# Altium schematic sheet Sheet1.SchDoc
size A4
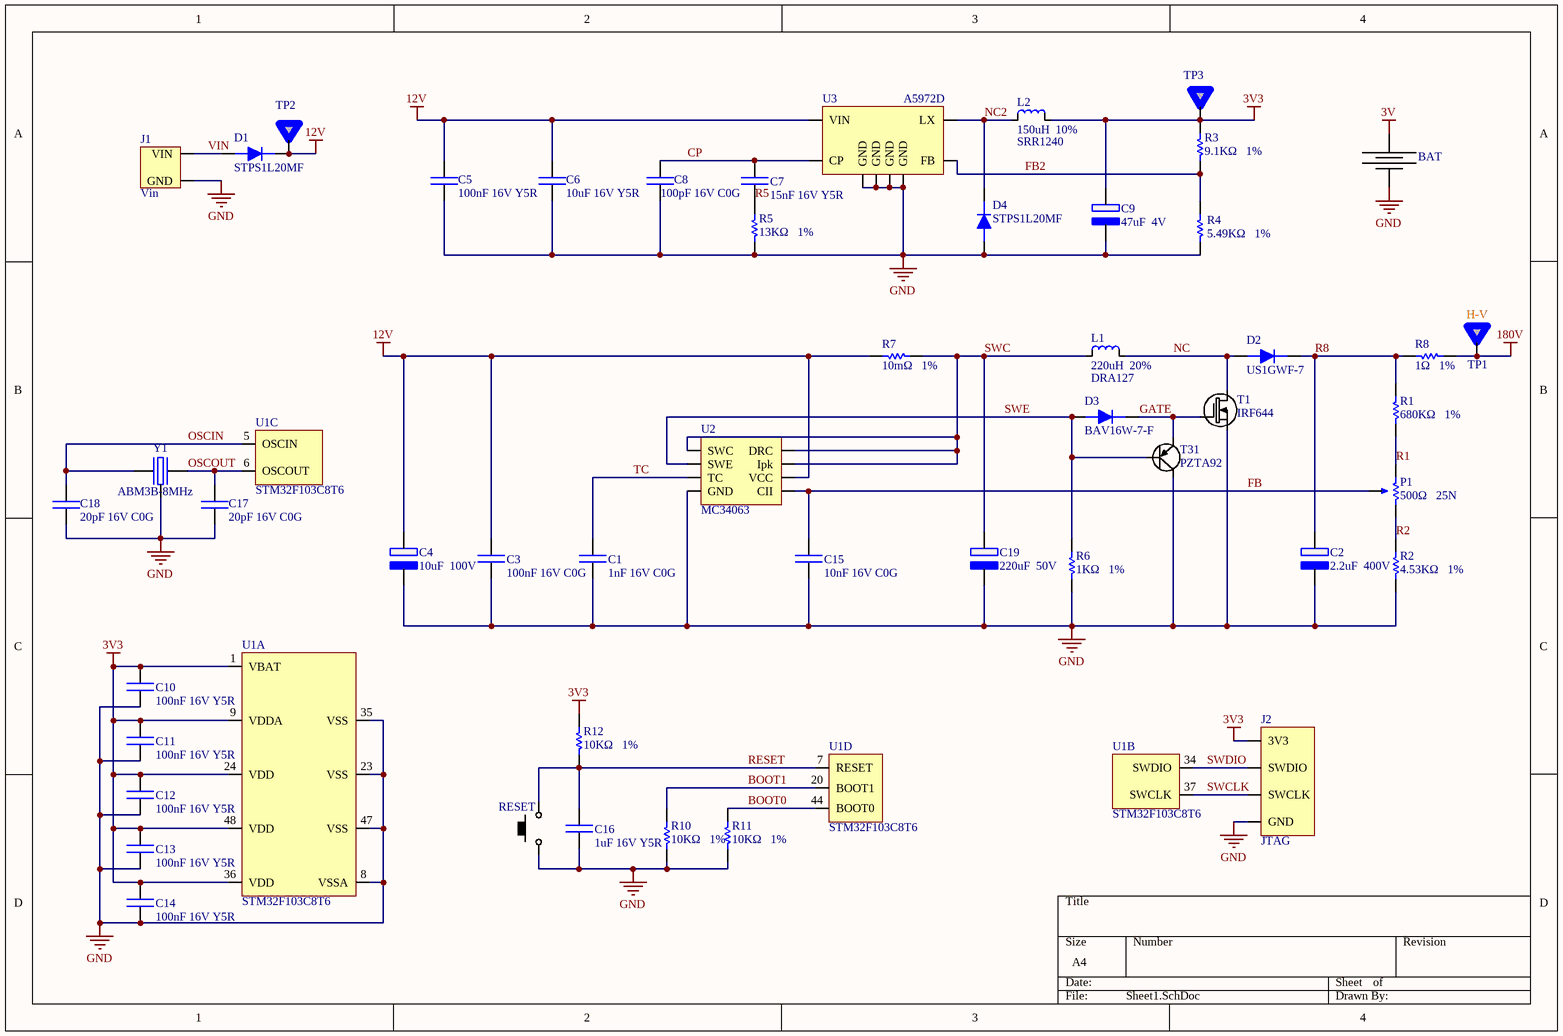
[diagram p0: Sheet1.SchDoc]

## Parts
BAT  3V  [HOLDER-2032]  (value not drawn)
C1  1nF 16V C0G  [0603]
C2  2.2uF  400V  [CAP-SIZE-F]
C3  100nF 16V C0G  [0603]
C4  10uF  100V  [CAP-SIZE-F]
C5  100nF 16V Y5R  [0603]
C6  10uF 16V Y5R  [0603]
C7  15nF 16V Y5R  [0603]
C8  100pF 16V C0G  [0603]
C9  47uF  4V  [AVX-B-CASE]
C10  100nF 16V Y5R  [0603]
C11  100nF 16V Y5R  [0603]
C12  100nF 16V Y5R  [0603]
C13  100nF 16V Y5R  [0603]
C14  100nF 16V Y5R  [0603]
C15  10nF 16V C0G  [0603]
C16  1uF 16V Y5R  [0603]
C17  20pF 16V C0G  [0603]
C18  20pF 16V C0G  [0603]
C19  220uF  50V  [CAP-SIZE-F]
D1  STPS1L20MF  [DO-222AA]
D2  US1GWF-7  [SOD-123F]
D3  BAV16W-7-F  [SOD-123F]
D4  STPS1L20MF  [DO-222AA]
J1  Vin  [BORNERAx2]
J2  JTAG  [PIN-HEADERx4]
L1  220uH  20%  [DRA127]
L2  150uH  10%  [SRR1240]
P1  500Ω   25N  [3296W]
R1  680KΩ   1%  [0603]
R2  4.53KΩ   1%  [0603]
R3  9.1KΩ   1%  [0603]
R4  5.49KΩ   1%  [0603]
R5  13KΩ   1%  [0603]
R6  1KΩ   1%  [0603]
R7  10mΩ   1%  [0603]
R8  1Ω   1%  [0603]
R10  10KΩ   1%  [0603]
R11  10KΩ   1%  [0603]
R12  10KΩ   1%  [0603]
RESET  RESET  [FSMSM]  (value not drawn)
T1  IRF644  [TO263-3S]
T31  PZTA92  [SOT-23]
TP1  HV-TEST-POINT  [Test_Point_HV]  (value not drawn)
TP2  TEST-POINT  [Test_Point]  (value not drawn)
TP3  TEST-POINT  [Test_Point]  (value not drawn)
U1  STM32F103C8T6  [LQFP48]  (parts A,B,C,D of 8)
U2  MC34063  [SOIC-8]
U3  A5972D  [SOIC-8]
Y1  ABM3B-8MHz  [ABM3B]

## Nets
3V: BAT.1(+)
3V3: C9.2 C10.1 C11.1 C12.1 C13.1 C14.1 J2.1(3V3) L2.2 R3.2 R12.2 TP3.1 U1.1(VBAT) U1.9(VDDA) U1.24(VDD) U1.36(VDD) U1.48(VDD)
12V: C3.2 C4.2 C5.2 C6.2 D1.2 R7.1 TP2.1 U2.6(VCC) U3.8(VIN)
180V: R8.2 TP1.1
GND: BAT.2(-) C1.1 C2.1 C3.1 C4.1 C5.1 C6.1 C8.1 C9.1 C10.2 C11.2 C12.2 C13.2 C14.2 C15.1 C16.1 C17.1 C18.1 C19.1 D4.1 J1.2(GND) J2.4(GND) R2.1 R4.2 R5.1 R6.1 R10.1 R11.1 RESET.2 T1.2(S) T31.3(C) U1.8(VSSA) U1.23(VSS) U1.35(VSS) U1.47(VSS) U2.4(GND) U3.2(GND) U3.3(GND) U3.6(GND) U3.7(GND) Y1.3
BOOT0: R11.2 U1.44(BOOT0)
BOOT1: R10.2 U1.20(BOOT1)
CP: C7.2 C8.2 U3.4(CP)
FB: C15.2 P1.2 U2.5(CII)
FB2: R3.1 R4.1 U3.5(FB)
GATE: D3.2 T1.1(G) T31.2(E)
NC: D2.1 L1.2 T1.3(D)
NC2: D4.2 L2.1 U3.1(LX)
OSCIN: C18.2 U1.5(OSCIN) Y1.1
OSCOUT: C17.2 U1.6(OSCOUT) Y1.2
R1: P1.3 R1.1
R2: P1.1 R2.2
R5: C7.1 R5.2
R8: C2.2 D2.2 R1.2 R8.1
RESET: C16.2 R12.1 RESET.1 U1.7(RESET)
SWC: C19.2 L1.1 R7.2 U2.1(SWC) U2.7(Ipk) U2.8(DRC)
SWCLK: J2.3(SWCLK) U1.37(SWCLK)
SWDIO: J2.2(SWDIO) U1.34(SWDIO)
SWE: D3.1 R6.2 T31.1(B) U2.2(SWE)
TC: C1.2 U2.3(TC)
VIN: D1.1 J1.1(VIN)

## Notes on the sheet
- (near L2) SRR1240
- (near L1) DRA127
- (in symbol HV-TEST-POINT) H-V

## Library data of the parts
BAT = BAT
C1 C3 C5-C8 C10-C18 = CAP
C2 C4 C9 C19 = CAP_pol
D1-D4 = DIO
L1 L2 = IND
P1 = POTE
R1-R8 R10-R12 = RES
RESET = BUTTON
T1 = N-MOS
T31 = PNP
Y1 = Cristal